# EAGLE board 17341 (EAGLE 7.6.0), part 1 of 2
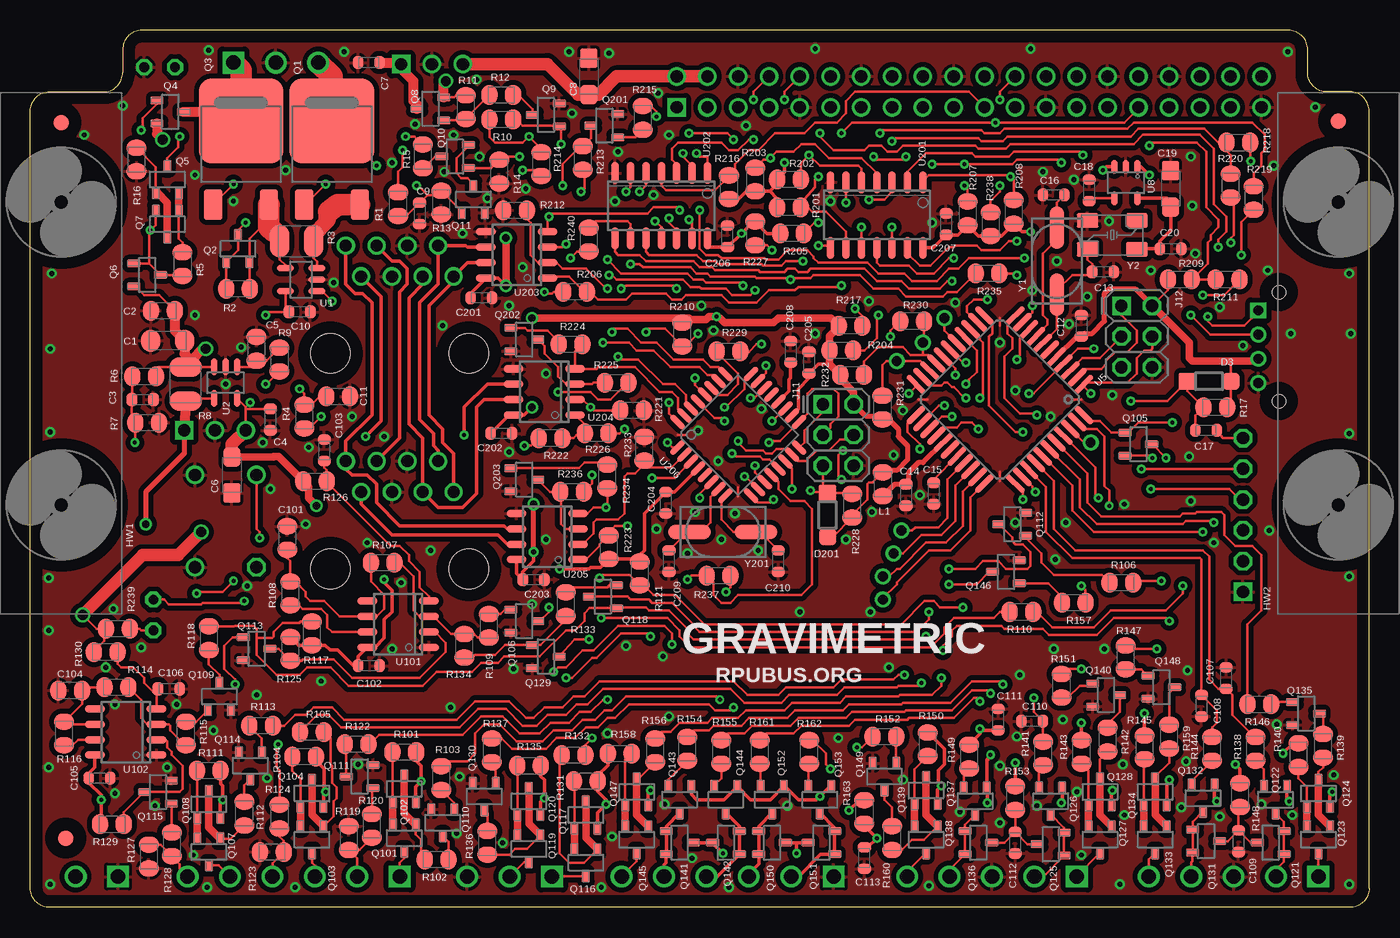
[diagram p3: board, top side]
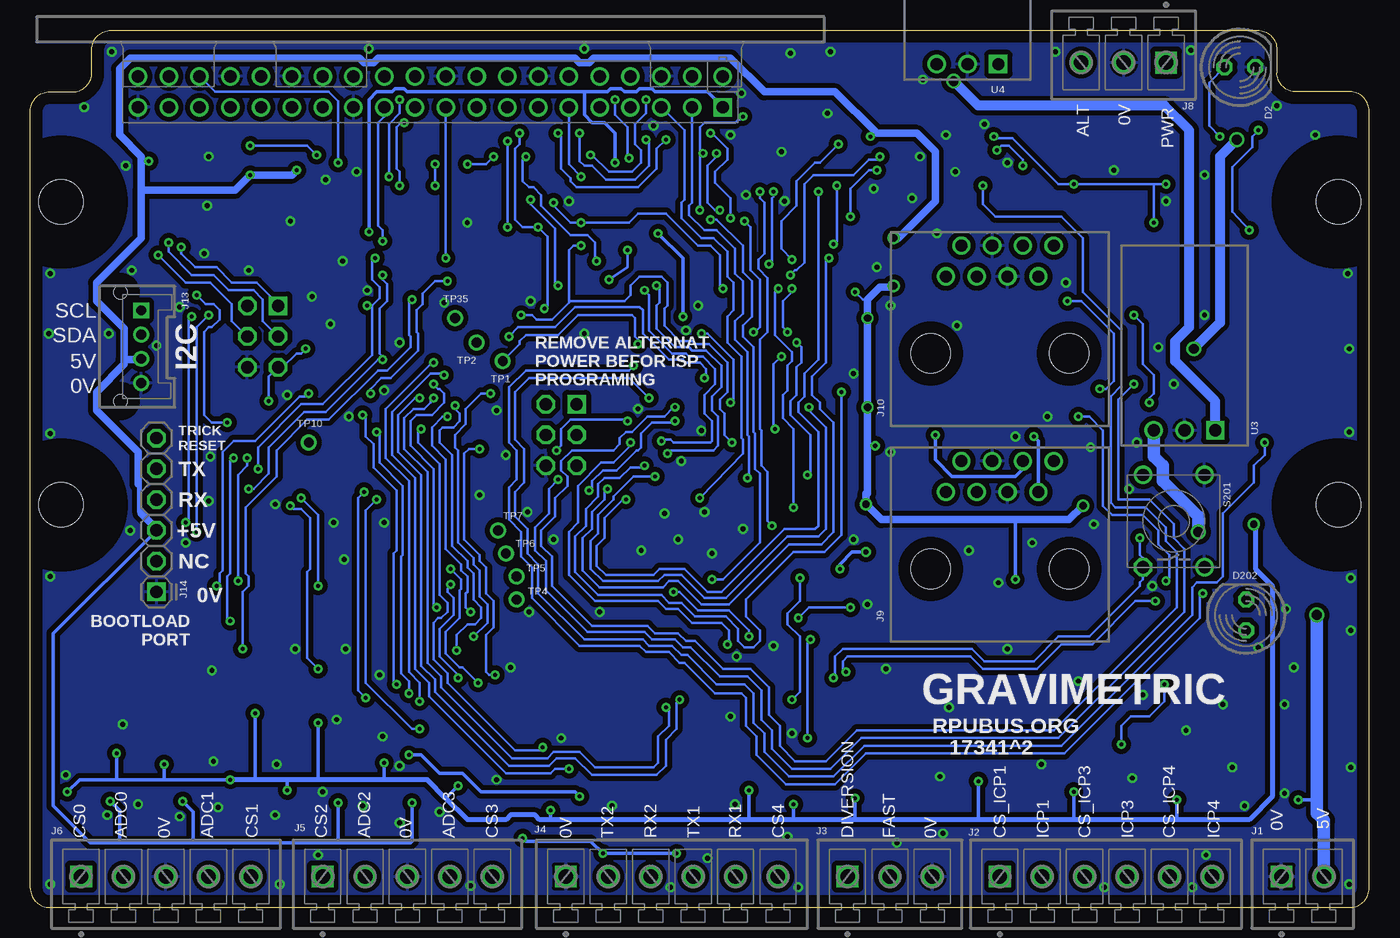
[diagram p4: board, bottom side, seen from below]

Size 110.49 x 72.39 mm. Coordinates in mm from the lower left corner, seen from the top.
Outline: 110.49,1.59 110.49,65.72 arc90 108.9,67.31 107,67.31 arc-90 105.41,68.9 105.41,70.8 arc90 103.82,72.39 9.21,72.39 arc90 7.62,70.8 7.62,68.9 arc-90 6.03,67.31 1.59,67.31 arc90 0,65.72 0,1.59 arc90 1.59,0 108.9,0 arc90 110.49,1.59
Copper layers (1*16): Top 0.034290625mm / dielectric 60mil / Bottom 0.034290625mm
Design rules "default *": minimum track width 7mil, minimum drill 13mil, track to track 12mil, track to pad 10mil, pad to pad 8mil, via to via 12mil, smd to smd 8mil, copper to edge 40mil, drill to drill 16mil, minimum pad ring 10mil, minimum via ring 8mil, stop-mask expansion 4mil, vias tented up to drill 17mil, thermal gap 10mil
Net classes: 0 default: width 0.178 mm, drill 0.33 mm

## Footprints (pad centres in the part's own frame; a part is rotated, then mirrored left to right if it is on the bottom)
C1206(3216) = smd 1.6 x 1.8: 1 -1.4,0; 2 1.4,0
C0805(2012) = smd 1.321 x 1.651: 1 -0.977,0; 2 0.977,0
C0603(1608) = smd 0.898 x 1.1: 1 -0.889,0; 2 0.889,0
3216 = smd 1.6 x 1.4: + -1.5,0; - 1.5,0
LED5MM = drill 0.813 octagon: A -1.27,0; K 1.27,0
SOD123 = smd 1.4 x 1.4: A 1.8,0; C -1.8,0
USA10 = hole 3.658: -12.5,0; 12.5,0
MCV2 = drill 1.2 square: 1 0,0 | drill 1.2: 2 3.5,0
MCV6 = drill 1.2 square: 1 0,0 | drill 1.2: 2 3.5,0; 3 7,0; 4 10.5,0; 5 14,0; 6 17.5,0
MCV3 = drill 1.2 square: 1 0,0 | drill 1.2: 2 3.5,0; 3 7,0
MCV5 = drill 1.2 square: 1 0,0 | drill 1.2: 2 3.5,0; 3 7,0; 4 10.5,0; 5 14,0
RASPI_ZERO_V40PIN = drill 1.016 square: 1 0,2.54 | drill 1.016: 2 0,0; 3 2.54,2.54; 4 2.54,0; 5 5.08,2.54; 6 5.08,0; 7 7.62,2.54; 8 7.62,0; 9 10.16,2.54; 10 10.16,0; 11 12.7,2.54; 12 12.7,0; 13 15.24,2.54; 14 15.24,0; 15 17.78,2.54; 16 17.78,0; 17 20.32,2.54; 18 20.32,0; 19 22.86,2.54; 20 22.86,0; 21 25.4,2.54; 22 25.4,0; 23 27.94,2.54; 24 27.94,0; 25 30.48,2.54; 26 30.48,0; 27 33.02,2.54; 28 33.02,0; 29 35.56,2.54; 30 35.56,0; 31 38.1,2.54; 32 38.1,0; 33 40.64,2.54; 34 40.64,0; 35 43.18,2.54; 36 43.18,0; 37 45.72,2.54; 38 45.72,0; 39 48.26,2.54; 40 48.26,0
RJ45-8HZT = drill 1: 1 -4.445,6.35; 2 -3.175,8.89; 3 -1.905,6.35; 4 -0.635,8.89; 5 0.635,6.35; 6 1.905,8.89; 7 3.175,6.35; 8 4.445,8.89 | hole 3.264: -5.715,0; 5.715,0
ISP = drill 1.016 square: 1 0,0 | drill 1.016 octagon: 2 0,2.54; 3 2.54,0; 4 2.54,2.54; 5 5.08,0; 6 5.08,2.54
B04B = drill 0.8 square: 1 0,0 | drill 0.8: 2 2,0; 3 4,0; 4 6,0 | hole 1.1: 7.5,-1.7; -1.5,-1.7
FRIEND = drill 1.016 square: 1 0,0 | drill 1.016 octagon: 2 2.54,0; 3 5.08,0; 4 7.62,0; 5 10.16,0; 6 12.7,0
DPAK = smd 1.5 x 2.5: 1 -2.3,-6.9; 3 2.3,-6.9 | smd 7 x 7: SINK 0,0
SOT23 = smd 0.65 x 1.06: B -0.95,-1.1; C 0,1.1; E 0.95,-1.1
SOT23' = smd 0.65 x 1.06: 1(G) -0.95,-1.1; 2(S) 0.95,-1.1; 3(D) 0,1.1
C1210(3225) = smd 1.6 x 2.7: 1 -1.4,0; 2 1.4,0
0M311 = drill 1.016 octagon: 1 -3.81,2.54 | drill 1.016: 2 3.81,2.54; 3 -3.81,-2.54; 4 3.81,-2.54
P1-08 = drill 0.813: TP 0,0
SOT23-5 = smd 0.55 x 1.4: 1 -0.95,-1.3; 2 0,-1.3; 3 0.95,-1.3; 4 0.95,1.3; 5 -0.95,1.3
OKI-78SR-H = drill 1.016 square: 1 0,0 | drill 1.016: 2 -2.54,0; 3 -5.08,0
TQFP44 = smd 2 x 0.45: 1 -5.8,4; 2 -5.8,3.2; 3 -5.8,2.4; 4 -5.8,1.6; 5 -5.8,0.8; 6 -5.8,0; 7 -5.8,-0.8; 8 -5.8,-1.6; 9 -5.8,-2.4; 10 -5.8,-3.2; 11 -5.8,-4; 23 5.8,-4; 24 5.8,-3.2; 25 5.8,-2.4; 26 5.8,-1.6; 27 5.8,-0.8; 28 5.8,0; 29 5.8,0.8; 30 5.8,1.6; 31 5.8,2.4; 32 5.8,3.2; 33 5.8,4 | smd 0.45 x 2: 12 -4,-5.8; 13 -3.2,-5.8; 14 -2.4,-5.8; 15 -1.6,-5.8; 16 -0.8,-5.8; 17 0,-5.8; 18 0.8,-5.8; 19 1.6,-5.8; 20 2.4,-5.8; 21 3.2,-5.8; 22 4,-5.8; 34 4,5.8; 35 3.2,5.8; 36 2.4,5.8; 37 1.6,5.8; 38 0.8,5.8; 39 0,5.8; 40 -0.8,5.8; 41 -1.6,5.8; 42 -2.4,5.8; 43 -3.2,5.8; 44 -4,5.8
SOT23-5,SOT25 = smd 0.55 x 1.2: 1 -0.95,-1.3; 2 0,-1.3; 3 0.95,-1.3; 4 0.95,1.3; 5 -0.95,1.3
SOIC8 = smd 0.6 x 1.6: 1 -1.905,-2.54; 2 -0.635,-2.54; 3 0.635,-2.54; 4 1.905,-2.54; 5 1.905,2.54; 6 0.635,2.54; 7 -0.635,2.54; 8 -1.905,2.54
14SOIC = smd 0.6 x 1.8: 1 -3.81,-2.7; 2 -2.54,-2.7; 3 -1.27,-2.7; 4 0,-2.7; 5 1.27,-2.7; 6 2.54,-2.7; 7 3.81,-2.7; 8 3.81,2.7; 9 2.54,2.7; 10 1.27,2.7; 11 0,2.7; 12 -1.27,2.7; 13 -2.54,2.7; 14 -3.81,2.7
TQFP32-08 = smd 1.5 x 0.45: 1 -4.293,2.8; 2 -4.293,2; 3 -4.293,1.2; 4 -4.293,0.4; 5 -4.293,-0.4; 6 -4.293,-1.2; 7 -4.293,-2; 8 -4.293,-2.8; 17 4.293,-2.8; 18 4.293,-2; 19 4.293,-1.2; 20 4.293,-0.4; 21 4.293,0.4; 22 4.293,1.2; 23 4.293,2; 24 4.293,2.8 | smd 0.45 x 1.5: 9 -2.8,-4.293; 10 -2,-4.293; 11 -1.2,-4.293; 12 -0.4,-4.293; 13 0.4,-4.293; 14 1.2,-4.293; 15 2,-4.293; 16 2.8,-4.293; 25 2.8,4.293; 26 2,4.293; 27 1.2,4.293; 28 0.4,4.293; 29 -0.4,4.293; 30 -1.2,4.293; 31 -2,4.293; 32 -2.8,4.293
FIDUCIAL-1.27 = smd 1.27 x 1.27: 1 0,0
CSM-3X = smd 3.5 x 1.2: 1 -2.75,0; 2 2.75,0
CRYSTAL5X3.2MM = smd 1.778 x 1.194: 1 -2.032,-1.194; 2 2.032,-1.194; 3 2.032,1.194; 4 -2.032,1.194

## Placement (x,y rotation side)
C1  10uF  [C1206(3216)]  11.34,46.77 180 top
C2  .1uF  [C0805(2012)]  10.94,49.25 180 top
C3  .01uF  [C0603(1608)]  9.27,41.91 0 top
C4  .1uF  [C0603(1608)]  19.81,40.26 270 top
C5  1uF  [C0805(2012)]  18.67,46.1 90 top
C6  106A  [3216]  16.64,35.69 270 top
C7  .1uF  [C0603(1608)]  27.94,69.72 180 top
C8  10uF  [3216]  46.1,68.58 90 top
C9  .01uF  [C0603(1608)]  32.13,57.28 270 top
C10  .1uF  [C0603(1608)]  22.23,49.15 0 top
C11  1uF  [C0805(2012)]  25.4,42.16 0 top
C12  .1uF  [C0603(1608)]  86.74,48.01 90 top
C13  27pF  [C0603(1608)]  88.52,52.45 180 top
C14  .1uF  [C0603(1608)]  72.26,34.04 270 top
C15  .1uF  [C0603(1608)]  74.55,34.16 270 top
C16  27pF  [C0603(1608)]  84.45,58.8 0 top
C17  .1uF  [C0603(1608)]  97.03,39.37 0 top
C18  470pF  [C0603(1608)]  87.38,59.18 90 top
C19  10uF  [3216]  94.11,59.31 90 top
C20  .1uF  [C0603(1608)]  94.11,54.36 0 top
C101  .01uF  [C0805(2012)]  21.21,30.48 90 top
C102  100nF  [C0603(1608)]  27.94,19.94 0 top
C103  100nF  [C0603(1608)]  24.26,37.72 90 top
C104  0.01uF  [C0805(2012)]  3.3,17.91 180 top
C105  100nF  [C0603(1608)]  5.71,10.67 0 top
C106  100nF  [C0603(1608)]  11.43,18.03 0 top
C107  .01uF  [C0603(1608)]  98.68,18.92 90 top
C108  .01uF  [C0603(1608)]  96.65,16.64 270 top
C109  .1uF  [C0603(1608)]  99.7,5.46 270 top
C110  .01uF  [C0603(1608)]  82.68,15.37 180 top
C111  .01uF  [C0603(1608)]  79.88,15.49 90 top
C112  .1uF  [C0603(1608)]  81.28,5.33 270 top
C113  .1uF  [C0603(1608)]  68.83,4.06 270 top
C201  .1uF  [C0603(1608)]  37.21,50.29 0 top
C202  .1uF  [C0603(1608)]  38.86,39.12 0 top
C203  .1uF  [C0603(1608)]  41.53,27.05 0 top
C204  .1uF  [C0603(1608)]  52.45,33.4 270 top
C205  .1uF  [C0603(1608)]  64.26,44.96 90 top
C206  .1uF  [C0603(1608)]  57.53,55.37 90 top
C207  .1uF  [C0603(1608)]  75.56,56.39 90 top
C208  .1uF  [C0603(1608)]  62.74,45.85 90 top
C209  27pF  [C0603(1608)]  52.7,28.57 270 top
C210  27pF  [C0603(1608)]  61.72,28.57 270 top
D2  5MMGN  [LED5MM]  10.67,69.34 0 bottom
D3  T4  [SOD123]  97.28,43.43 180 top
D201  T4  [SOD123]  65.79,32.38 90 top
D202  5MMRD  [LED5MM]  10.16,24.13 90 bottom
HW1  USA10-4,6  [USA10]  2.54,45.72 90 top
HW2  USA10-4,6  [USA10]  107.95,45.72 90 top
J1  PST1,0/2-3,5  [MCV2]  7.24,2.54 0 bottom
J2  PST1,0/6-3,5  [MCV6]  30.48,2.54 0 bottom
J3  PST1,0/3-3,5  [MCV3]  43.05,2.54 0 bottom
J4  [MCV6]  66.29,2.54 0 bottom
J5  PST1,0/5-3,5  [MCV5]  86.36,2.54 0 bottom
J6  PST1,0/5-3,5  [MCV5]  106.3,2.54 0 bottom
J7  Pi Zero  [RASPI_ZERO_V40PIN]  53.34,68.58 180 bottom
J8  PST1,0/3-3,5  [MCV3]  16.76,69.72 180 bottom
J9  RJ45J  [RJ45-8HZT]  30.48,27.94 0 bottom
J10  RJ45J  [RJ45-8HZT]  30.48,45.72 0 bottom
J11  [ISP]  65.41,41.53 270 top
J12  ICSP  [ISP]  90.04,49.66 270 top
J13  S04B  [B04B]  101.35,49.28 270 bottom
J14  FRIEND  [FRIEND]  100.08,26.04 90 bottom
L1  JMP  [C0805(2012)]  70.36,34.92 270 top
Q1  IRFR5305  [DPAK]  24.89,64.9 0 top
Q2  K1N  [SOT23]  17.14,54.36 0 top
Q3  IRFR5305  [DPAK]  17.4,64.9 0 top
Q4  P65  [SOT23']  11.56,65.66 270 top
Q5  K3N  [SOT23]  11.3,60.07 0 top
Q6  K1N  [SOT23]  9.65,52.2 270 top
Q7  K3N  [SOT23]  11.3,56.39 180 top
Q8  P65  [SOT23']  33.02,65.91 90 top
Q9  K38  [SOT23']  42.54,65.41 90 top
Q10  K38  [SOT23']  35.05,61.98 90 top
Q11  K38  [SOT23']  36.58,58.42 0 top
Q101  K3N  [SOT23]  30.86,5.71 180 top
Q102  K3N  [SOT23]  30.86,9.78 0 top
Q103  K3N  [SOT23]  23.24,5.59 180 top
Q104  K3N  [SOT23]  23.24,9.4 0 top
Q105  K38  [SOT23']  91.44,38.23 270 top
Q106  K1N  [SOT23]  40.77,23.62 270 top
Q107  K3N  [SOT23]  14.73,4.57 180 top
Q108  K3N  [SOT23]  14.73,8.51 0 top
Q109  K1N  [SOT23]  15.62,17.4 0 top
Q110  K1N  [SOT23]  34.04,6.99 180 top
Q111  K1N  [SOT23]  27.18,10.79 90 top
Q112  K1N  [SOT23]  81.03,31.62 90 top
Q113  K1N  [SOT23]  18.67,21.34 270 top
Q114  K1N  [SOT23]  18.16,11.68 180 top
Q115  K1N  [SOT23]  10.54,9.53 90 top
Q116  K3N  [SOT23]  45.85,3.68 180 top
Q117  K3N  [SOT23]  45.85,7.62 0 top
Q118  K38  [SOT23']  47.24,25.65 90 top
Q119  K3N  [SOT23]  41.15,4.83 180 top
Q120  K3N  [SOT23]  41.15,8.76 0 top
Q121  K1N  [SOT23]  102.36,5.33 90 top
Q122  K38  [SOT23']  102.74,8.89 180 top
Q123  K3N  [SOT23]  106.3,5.59 180 top
Q124  K3N  [SOT23]  106.3,9.4 0 top
Q125  K1N  [SOT23]  84.2,5.21 90 top
Q126  K38  [SOT23']  84.2,8.76 180 top
Q127  K3N  [SOT23]  88.27,5.59 180 top
Q128  K3N  [SOT23]  88.27,9.53 0 top
Q129  K1N  [SOT23]  42.54,20.7 270 top
Q130  K1N  [SOT23]  37.46,9.14 180 top
Q131  K1N  [SOT23]  97.03,5.46 270 top
Q132  K38  [SOT23']  96.77,9.02 180 top
Q133  K3N  [SOT23]  92.84,5.59 180 top
Q134  K3N  [SOT23]  92.84,9.53 0 top
Q135  K1N  [SOT23]  105.28,16 270 top
Q136  K1N  [SOT23]  78.23,5.33 270 top
Q137  K38  [SOT23']  77.98,8.76 180 top
Q138  K3N  [SOT23]  73.91,5.59 180 top
Q139  K3N  [SOT23]  73.91,9.65 0 top
Q140  K1N  [SOT23]  88.77,17.53 270 top
Q141  K1N  [SOT23]  53.59,5.33 270 top
Q142  K1N  [SOT23]  57.4,5.33 90 top
Q143  K38  [SOT23']  53.59,8.89 180 top
Q144  K38  [SOT23']  57.4,8.89 180 top
Q145  K3N  [SOT23]  50.04,5.59 180 top
Q146  K1N  [SOT23]  80.52,27.69 90 top
Q147  K3N  [SOT23]  50.04,9.53 0 top
Q148  K1N  [SOT23]  93.34,18.16 270 top
Q149  K1N  [SOT23]  70.48,10.79 180 top
Q150  K1N  [SOT23]  61.21,5.33 270 top
Q151  K1N  [SOT23]  65.28,5.33 90 top
Q152  K38  [SOT23']  61.21,8.89 180 top
Q153  K38  [SOT23']  65.15,8.89 180 top
Q201  K1N  [SOT23]  47.37,64.52 90 top
Q202  K1N  [SOT23]  40.77,46.86 270 top
Q203  K1N  [SOT23]  40.77,35.31 270 top
R1  100k  [C0805(2012)]  30.35,58.04 90 top
R2  100k  [C0805(2012)]  17.14,51.05 0 top
R3  0.018  [C1210(3225)]  21.97,54.99 0 top
R4  10k  [C0805(2012)]  22.61,40.51 90 top
R5  1K  [C0805(2012)]  12.57,53.09 270 top
R6  100k  [C0805(2012)]  9.4,43.81 0 top
R7  15.8k  [C0805(2012)]  9.65,40.01 180 top
R8  0.068  [C1210(3225)]  12.83,43.18 90 top
R9  10k  [C0805(2012)]  20.57,45.21 90 top
R10  10k  [C0805(2012)]  38.86,65.02 180 top
R11  100k  [C0805(2012)]  35.94,66.04 270 top
R12  80.6k  [C0805(2012)]  38.86,67.06 0 top
R13  10k  [C0805(2012)]  33.91,58.17 90 top
R14  10k  [C0805(2012)]  38.7,60.72 270 top
R15  49.9k  [C0805(2012)]  32.38,61.98 90 top
R16  100k  [C0805(2012)]  8.76,61.72 90 top
R17  10K  [C0805(2012)]  97.79,41.27 0 top
R101  32.4  [C0805(2012)]  30.86,12.83 0 top
R102  49.9k  [C0805(2012)]  33.53,3.94 180 top
R103  10k  [C0805(2012)]  33.91,10.67 270 top
R104  32.4  [C0805(2012)]  22.61,12.45 0 top
R105  49.9k  [C0805(2012)]  23.24,14.48 0 top
R106  10k  [C0805(2012)]  90.04,26.8 180 top
R107  100k  [C0805(2012)]  29.08,28.45 0 top
R108  182  [C0805(2012)]  21.46,25.91 270 top
R109  10k  [C0805(2012)]  37.85,23.24 90 top
R110  182  [C0805(2012)]  81.79,24.38 180 top
R111  32.4  [C0805(2012)]  14.73,11.3 0 top
R112  49.9k  [C0805(2012)]  17.65,7.75 270 top
R113  10k  [C0805(2012)]  19.05,14.99 180 top
R114  100k  [C0805(2012)]  7.11,18.16 0 top
R115  10k  [C0805(2012)]  12.83,14.35 90 top
R116  182  [C0805(2012)]  2.79,14.35 270 top
R117  10k  [C0805(2012)]  23.24,22.61 90 top
R118  182  [C0805(2012)]  14.73,22.23 90 top
R119  100  [C0805(2012)]  26.29,5.71 270 top
R120  10k  [C0805(2012)]  28.19,6.73 90 top
R121  10k  [C0805(2012)]  50.29,27.56 270 top
R122  182  [C0805(2012)]  26.92,13.46 0 top
R123  100  [C0805(2012)]  19.94,4.57 0 top
R124  10k  [C0805(2012)]  20.57,7.49 90 top
R125  10k  [C0805(2012)]  21.46,21.34 270 top
R126  100k  [C0805(2012)]  23.5,35.18 180 top
R127  100  [C0805(2012)]  9.78,4.19 90 top
R128  10k  [C0805(2012)]  11.68,5.21 90 top
R129  10k  [C0805(2012)]  6.73,6.86 0 top
R130  100k  [C0805(2012)]  6.22,21.08 180 top
R131  27  [C0805(2012)]  45.85,10.41 0 top
R132  49.9k  [C0805(2012)]  44.83,12.57 180 top
R133  10k  [C0805(2012)]  44.2,25.02 270 top
R134  10k  [C0805(2012)]  35.81,21.59 270 top
R135  27  [C0805(2012)]  41.15,11.68 0 top
R136  49.9k  [C0805(2012)]  37.72,5.33 270 top
R137  10k  [C0805(2012)]  38.1,12.95 270 top
R138  127  [C0805(2012)]  101.09,13.08 90 top
R139  49.9k  [C0805(2012)]  106.68,13.34 270 top
R140  27  [C0805(2012)]  104.65,12.57 90 top
R141  127  [C0805(2012)]  83.57,12.7 90 top
R142  49.9k  [C0805(2012)]  88.9,13.84 270 top
R143  27  [C0805(2012)]  86.74,12.83 90 top
R144  127  [C0805(2012)]  97.54,13.08 90 top
R145  27  [C0805(2012)]  91.95,13.21 90 top
R146  10k  [C0805(2012)]  101.41,16.76 180 top
R147  10k  [C0805(2012)]  90.39,20.63 90 top
R148  100K  [C0805(2012)]  99.82,9.27 270 top
R149  127  [C0805(2012)]  77.47,12.45 90 top
R150  27  [C0805(2012)]  74.04,13.46 90 top
R151  10k  [C0805(2012)]  85.09,18.29 90 top
R152  10k  [C0805(2012)]  70.48,14.1 180 top
R153  100K  [C0805(2012)]  81.28,9.02 270 top
R154  127  [C0805(2012)]  54.23,13.08 90 top
R155  127  [C0805(2012)]  57.02,12.83 90 top
R156  49.9k  [C0805(2012)]  51.56,12.95 270 top
R157  10k  [C0805(2012)]  86.11,25.15 0 top
R158  27  [C0805(2012)]  48.64,12.7 180 top
R159  49.9k  [C0805(2012)]  93.98,14.1 270 top
R160  49.9k  [C0805(2012)]  71.12,5.71 270 top
R161  127  [C0805(2012)]  60.2,12.83 90 top
R162  127  [C0805(2012)]  64.26,12.83 90 top
R163  100K  [C0805(2012)]  68.83,7.87 270 top
R201  10k  [C0805(2012)]  62.61,57.78 0 top
R202  10k  [C0805(2012)]  62.61,60.07 0 top
R203  1.82k  [C0805(2012)]  59.82,60.07 270 top
R204  3.01k  [C0805(2012)]  66.93,45.97 180 top
R205  3.01k  [C0805(2012)]  62.87,55.63 180 top
R206  10k  [C0805(2012)]  44.96,50.8 180 top
R207  10k  [C0805(2012)]  77.34,57.28 270 top
R208  10k  [C0805(2012)]  81.15,57.4 270 top
R209  3.01k  [C0805(2012)]  94.87,51.82 0 top
R210  10k  [C0805(2012)]  53.81,47.28 90 top
R211  182  [C0805(2012)]  98.81,51.82 180 top
R212  3.01k  [C0805(2012)]  40,57.53 0 top
R213  3.01k  [C0805(2012)]  45.59,61.85 270 top
R214  10K  [C0805(2012)]  42.16,61.34 270 top
R215  100k  [C0805(2012)]  50.55,65.15 90 top
R216  1.82k  [C0805(2012)]  57.66,59.44 90 top
R217  3.01k  [C0805(2012)]  67.69,48.01 0 top
R218  3.01k  [C0805(2012)]  99.7,63.12 180 top
R219  182  [C0805(2012)]  100.97,58.55 90 top
R220  182  [C0805(2012)]  99.06,59.56 90 top
R221  3.01k  [C0805(2012)]  49.66,41.02 180 top
R222  10k  [C0805(2012)]  42.93,38.73 180 top
R223  10k  [C0805(2012)]  47.75,29.72 270 top
R224  100k  [C0805(2012)]  44.58,46.48 0 top
R225  3.01k  [C0805(2012)]  48.39,43.31 0 top
R226  1.82k  [C0805(2012)]  46.74,39.12 0 top
R227  10K  [C0805(2012)]  59.82,55.63 270 top
R228  10K  [C0805(2012)]  67.82,33.15 270 top
R229  182  [C0805(2012)]  57.62,45.88 180 top
R230  182  [C0805(2012)]  72.77,48.39 180 top
R231  3.01k  [C0805(2012)]  70.32,41.26 270 top
R232  3.01k  [C0805(2012)]  67.82,43.94 180 top
R233  3.01k  [C0805(2012)]  50.67,37.85 90 top
R234  100k  [C0805(2012)]  47.62,35.56 90 top
R235  182  [C0805(2012)]  78.99,52.32 180 top
R236  3.01k  [C0805(2012)]  44.7,34.29 180 top
R237  1.82k  [C0805(2012)]  56.8,27.38 180 top
R238  10K  [C0805(2012)]  79.25,56.39 270 top
R239  1.82k  [C0805(2012)]  7.24,22.99 0 top
R240  10k  [C0805(2012)]  46.1,55.12 90 top
S201  KSA0M311  [0M311]  16.13,31.88 90 bottom
TP1  TPPAD1-08  [P1-08]  71.5,45.09 0 bottom
TP2  TPPAD1-08  [P1-08]  73.66,46.61 0 bottom
TP4  TPPAD1-08  [P1-08]  70.36,25.4 0 bottom
TP5  TPPAD1-08  [P1-08]  70.36,27.3 0 bottom
TP6  TPPAD1-08  [P1-08]  71.25,29.21 0 bottom
TP7  TPPAD1-08  [P1-08]  71.88,31.11 0 bottom
TP10  TPPAD1-08  [P1-08]  87.5,38.35 0 bottom
TP35  TPPAD1-08  [P1-08]  75.44,48.64 0 bottom
U1  1087  [SOT23-5]  22.35,51.82 90 top
U2  1087  [SOT23-5]  16.13,43.31 180 top
U3  I50115  [OKI-78SR-H]  12.7,39.37 0 bottom
U4  I50115  [OKI-78SR-H]  30.61,69.6 0 bottom
U5  ATMEGA324PB-AU  [TQFP44]  80.01,41.91 225 top
U8  KB33  [SOT23-5,SOT25]  90.42,59.82 180 top
U101  ICM7555  [SOIC8]  30.35,23.37 90 top
U102  ICM7555  [SOIC8]  7.87,14.48 90 top
U201  74LVC07A  [14SOIC]  69.85,57.15 180 top
U202  74LVC07A  [14SOIC]  52.07,57.91 180 top
U203  THVD1500  [SOIC8]  40.13,53.85 90 top
U204  THVD1500  [SOIC8]  42.42,42.55 90 top
U205  THVD1500  [SOIC8]  42.67,30.61 90 top
U206  ATMEGA328PB-AU  [TQFP32-08]  58.42,38.99 45 top
U$1  R-PI3B+  [R-PI3B+]  77.47,67.31 0 bottom
U$2  FIDUCIAL1.27  [FIDUCIAL-1.27]  107.95,64.9 0 top
U$3  FIDUCIAL1.27  [FIDUCIAL-1.27]  2.54,64.77 0 top
U$4  FIDUCIAL1.27  [FIDUCIAL-1.27]  2.92,5.71 0 top
Y1  16MHz  [CSM-3X]  84.71,53.34 90 top
Y2  FT5HNBPK16  [CRYSTAL5X3.2MM]  89.28,55.5 180 top
Y201  12MHz  [CSM-3X]  57.15,30.99 0 top

## Tracks (layer width: path | path; a pad name or v marks a point on that pad's centre or on a via)
0V  (via drill 0.41)
  Top 0.203: 53.47,38.99 54.1,38.99 | 58.42,33.91 58.42,34.67 | 80.01,35.18 80.01,35.94 | 86.11,41.91 86.74,41.91 | 74.04,41.91 73.28,41.91 | 80.01,48.01 80.01,48.64
  other vias: 4.45,63.75 1.78,52.32 1.65,46.1 1.65,39.24 1.52,27.18 1.65,1.91 44.45,70.61 47.75,70.48 25.91,70.61 29.21,38.86 36.83,68.33 6.99,9.4 6.99,16.76 11.3,11.56 10.29,8.38 1.52,22.86 1.52,11.56 51.69,31.24 81.28,42.67 100.08,46.35 29.84,21.34 30.61,26.8 27.05,11.81 35.18,6.1 48.01,5.84 52.32,8.51 54.61,4.06 85.47,31.75 58.17,32.51 60.32,41.15 56.77,36.83 54.23,29.21 54.86,32.64 57.02,30.35 74.42,56.52 87.25,50.42 84.71,53.34 82.68,50.93 86.11,60.07 89.03,56.64 64.77,47.37 60.07,29.46 40.64,52.83 39.5,49.66 42.54,44.07 90.3,33.27 95.63,37.21 89.28,42.29 98.17,49.53 104.01,47.37 102.11,52.58 102.62,61.21 106.05,66.04 108.84,52.32 108.97,47.37 95.76,33.53 102.23,31.11 108.84,27.3 108.84,1.91 89.92,1.91 74.17,1.78 62.48,8.38 57.66,1.65 47.12,1.65 21.84,1.65 14.61,1.65 19.56,10.67 15.11,14.61 9.14,21.46 6.22,19.81 42.54,30.35 27.81,30.1 33.02,29.46 41.4,25.02 24,18.67 18.67,17.53 34.67,16.51 39.88,19.68 49.15,21.59 70.87,19.81 81.66,19.18 88.65,21.34 95.5,19.56 95,8.26 85.22,15.49 86.74,4.32 83.06,8.38 80.01,6.99 76.71,7.87 80.01,11.68 81.41,14.1 84.45,21.34 69.34,24.38 7.62,66.17 14.73,70.74 25.02,51.56 31.75,64.64 34.92,63.75 37.72,58.55 44.7,65.53 48.51,62.36 40.89,59.31 35.69,55.63 34.04,48.01 51.43,58.8 59.05,64.52 103.76,70.61 95.76,61.98 95.89,57.91 92.46,52.58 83.57,60.71 66.04,58.29 85.73,48.13 108.84,39.12 97.66,30.1 84.58,28.7 52.2,20.7 63.5,24.38 69.47,32.64 67.31,30.35 66.67,13.97 16.13,43.18 19.18,38.35 22.99,37.97 26.54,40.51 22.73,31.62 19.81,34.54 6.86,24.64 64.77,70.87 82.55,70.87 96.14,53.98 107.57,10.92 104.14,7.62 98.17,7.49 101.6,8.51 102.87,15.11 95.38,12.06 90.17,11.81 90.3,7.62 86.36,9.53 72.01,10.54 48.26,58.29 51.82,67.18 52.7,63.75 17.4,46.23 13.59,48.9 17.91,26.54 16.76,58.29 13.59,60.45 21.08,60.83 29.84,61.47 34.16,60.71 37.08,61.98 69.22,50.04 76.33,49.91 55.37,49.66 81.28,31.75 55.12,39.37 39.5,37.59 56.39,47.62 71.25,37.34 73.41,34.04 52.7,15.75 47.62,14.35 35.43,10.79 38.99,5.33 13.46,4.32 12.07,16.76 72.01,41.02 80.01,46.61 84.2,40.51
  pour Bottom (isolate 0.406): 0,72.39 110.49,72.39 110.49,0 0,0
  pour Top (isolate 0.406, rank 6): 0,72.39 110.49,72.39 110.49,0 0,0
!RESET!  (via drill 0.33)
  Top 0.203: v87.76,46.1 86.46,46.1 U5.4 82.78,42.42 v82.42,42.42 | C17.1 96.14,40.6 R17.1 95.48,42.61 D3.A 93.83,41.78 v90.81,41.78 | U202.8 48.26,54.1 48.51,53.85 50.29,53.85 50.8,53.34 54.74,53.34 55.24,52.83 56.26,52.83 56.51,52.58 60.07,52.58 60.2,52.45 62.23,52.45 62.48,52.7 63.12,52.7 63.37,52.45 64.14,52.45 64.39,52.7 68.83,52.7 69.85,51.69 71.88,51.69 72.52,51.05 75.06,51.05 75.69,51.69 v76.07,51.69
  Bottom 0.203: v90.81,41.78 90.81,43.81 J12.5 89.66,44.58 88.52,45.72 88.14,45.72 v87.76,46.1 | v82.42,42.42 82.42,42.8 81.53,43.69 80.77,43.69 78.49,45.97 78.49,47.37 78.61,47.5 78.61,49.28 78.11,49.78 78.11,50.67 77.09,51.69 v76.07,51.69
!SS  (via drill 0.33)
  Top 0.203: v94.23,40.01 91.44,40.01 90.61,39.18 Q105.1(G) 89.22,39.18 88.27,40.13 87.45,40.13 U5.44 | v96.77,50.55 98.51,50.55 R211.1
  Bottom 0.203: v94.23,40.01 95.5,40.01 96.14,40.64 96.14,47.5 95.76,47.88 95.5,47.88 94.87,48.51 94.87,49.28 95.38,49.78 96.01,49.78 v96.77,50.55
+3V3
  Top 0.305: U8.5 93.8,58.52 C19.+ 94.11,55.88 93.22,54.99 C20.1 91.36,54.36 Y2.4
+5V  (via drill 0.33, 0.41, 0.61, 0.81)
  Top 0.203: U3.3 17.78,41.15 | 17.78,41.15 17.78,41.31 | 17.78,41.31 U2.5 | v4.32,24.13 5.46,22.99 R239.1 6.1,22.82 6.1,21.97 5.25,21.12 R130.2 | R214.1 42.16,62.61 v41.15,63.63 40.64,63.12 38.35,63.12 37.88,63.59 R10.2 | R17.2 99.08,41.59 D3.C 99.06,43.46 99.06,45.09 | J12.2 93.89,50.97 R209.1 | R218.1 100.67,61.63 v100.71,61.59 | L1.1 69.51,35.05 69.22,35.05 69.09,34.92 69.09,33.66 67.82,32.38 R228.2 66.23,30.59 D201.C | R222.2 41.31,38.1 v40.77,38.1 | C4.1 17.78,41.15 | R210.2 53.81,48.6 53.85,48.64 | Q137.1(G) 78.99,9.8 | v18.16,41.66 18.13,41.66 17.78,41.31 | v19.43,48.9 19.68,49.15 C10.1 21.05,49.43 U1.5 | R206.2 43.18,50.8 43.05,50.67 42.54,50.67 v42.42,50.8
  Top 0.305: U8.3 88.8,61.12 v88.52,60.83 | U8.1 91.66,61.12 v92.33,60.45 | R129.1 5.84,6.95 v5.84,8.89 5.84,9.27 4.83,10.29 C105.1 4.83,11.05 5.33,11.56 U102.8 | v29.21,27.05 29.21,26.8 29.84,26.16 29.84,24.38 29.21,23.75 29.21,22.23 28.45,21.46 U101.8 27.05,20.7 C102.1 26.67,19.94 25.36,21.25 24.73,21.25 24.34,21.63 R117.1 22.15,21.63 R125.1 | v41.53,29.34 41.53,28.57 40.64,27.69 C203.1 40.13,27.56 U205.8 | Q143.1(G) 54.54,9.34 54.99,8.89 57.25,8.89 Q144.1(G) 58.35,9.97 59.44,8.89 61.06,8.89 Q152.1(G) 62.27,9.99 63.37,8.89 64.87,8.89 65,8.99 v65.15,9.14 66,9.99 Q153.1(G) | Q126.1(G) 85.15,8.7 v85.09,8.64 | Q132.1(G) 97.72,8.96 v97.92,8.76 | Q122.1(G) 103.69,8.96 v103.89,8.76 | C201.1 36.32,50.67 U203.8 38.61,51.94 v39.24,51.31 | U202.14 55.97,54.48 C206.1 v58.67,55.63 59.65,56.6 R227.1 60.79,55.63 R205.2 | Q137.1(G) 78.93,12.13 v79.25,12.57 | U206.18 63.37,41.11 63.37,42.8 64.26,43.69 C205.1 65.02,44.83 65.95,44.83 | U206.4 53.15,34.29 C204.1 50.67,32.51 50.67,29.46 50.29,29.08 R121.1 50.09,28.74 R223.2 47.08,28.07 46.23,28.07 46.1,27.94 v43.69,27.94 | v41.4,41.27 40.77,40.64 U204.8 39.5,40.64 C202.1 | 78.99,9.8 v78.99,8.64
  Top 0.406: U5.5 86.35,47.12 C12.1 87,47.37 87.63,47.37 88.65,48.39 88.65,50.67 89.03,51.05 91.19,51.05 J12.2 | v41.53,29.34 v41.53,33.27 | J11.2 68.96,40.51 70.09,40.51 R231.2 70.36,40.24 70.36,40.26 70.87,40.26 71.63,39.5 71.63,38.86 72.39,38.1 72.39,36.96 71.5,36.07 70.52,36.07 L1.1
  Top 0.61: J13.3 101.22,45.09 99.06,45.09 95.89,45.09 95.63,45.34 95.63,46.61 J12.2 | v39.24,55.24 v39.24,51.31 | v41.4,48.64 53.85,48.64 54.36,48.64 54.48,48.51 55.75,48.51 56.01,48.77 v56.64,48.77 56.9,48.64 57.28,48.26 61.34,48.26 61.72,48.64 66.08,48.64 R217.1 66.67,47.88 65.95,47.16 R204.2 65.95,44.83 R232.2 66.84,43.65 67.95,42.55 J11.2 | C6.+ 20.09,37.19 20.07,37.21 20.49,37.21 R126.2 22.99,34.71 22.99,33.78 v23.62,33.15
  Top 1.016: C6.+ 16.64,38.23 U3.3 | v14.1,30.99 12.19,29.08 9.27,29.08 v4.32,24.13
  Bottom 0.203: 41.4,50.16 41.78,50.16 v42.42,50.8 | v100.71,61.59 101.22,61.59 101.35,61.47 | v40.77,38.1 41.4,38.1 | v41.15,63.63 40.77,64.01 | v18.16,41.66 18.16,42.04 17.78,42.42 17.78,43.94 18.67,44.83 18.67,48.13 v19.43,48.9
  Bottom 0.305: J14.3 108.59,22.61 108.59,8.38 105.54,5.33 103.12,5.33 | 4.32,8.89 v5.84,8.89 | v29.21,27.05 29.21,32 | v103.89,8.76 103.12,8 103.12,5.33 | v97.92,8.76 97.03,7.87 97.03,5.33 | 97.03,5.33 103.12,5.33 | v78.99,8.64 78.99,5.46 79.12,5.33 85.09,5.33 | 85.09,5.33 97.03,5.33 | v85.09,8.64 85.09,5.33 | v41.53,29.34 42.67,29.34 43.69,28.32 v43.69,27.94 | v56.64,48.77 56.64,53.59 v58.67,55.63 | v79.25,12.57 78.23,12.57 76.71,11.05 74.8,11.05 73.28,9.53 65.53,9.53 v65.15,9.14
  Bottom 0.406: 101.35,32.51 101.47,32.64 101.47,34.8 101.6,34.92
  Bottom 0.61: v23.62,33.15 24.77,32 29.21,32 40.26,32 v41.53,33.27 41.53,34.16 41.4,34.29 | J14.3 100.08,31.24 101.35,32.51 | 102.74,45.21 102.74,44.83 105.03,42.55 105.03,41.02 101.6,37.59 101.6,34.92 | 102.74,45.21 101.41,45.21 J13.3 | 102.74,45.21 102.74,47.75 105.03,50.04 105.03,51.56 101.35,55.24 101.35,59.18 | v88.52,60.83 88.9,60.45 v92.33,60.45 93.6,59.18 101.35,59.18 | 41.4,34.29 41.4,38.1 v41.4,41.27 v41.4,48.64 41.4,50.16 40.39,51.18 39.24,51.18 v39.24,51.31 | v39.24,55.24 38.86,55.24 35.81,58.29 35.81,62.36 37.34,63.88 40.64,63.88 40.77,64.01 44.07,67.31 49.91,67.31 52.7,70.1 64.01,70.1 64.39,69.72 65.15,69.72 65.53,70.1 81.79,70.1 82.17,69.72 82.93,69.72 83.31,70.1 102.23,70.1 103.12,69.22 103.12,63.75 101.35,61.98 101.35,61.47 101.35,59.18 | 41.4,34.16 41.4,34.29
  Bottom 1.016: U3.3 17.78,37.21 17.02,36.45 17.02,35.18 14.1,32.26 v14.1,30.99 | v4.32,24.13 4.32,8.89 4.32,7.75 3.74,7.17 J1.2
+5V_2PI
  Top 1.016: U4.3 42.67,69.6 45.19,67.08 C8.+ 46.89,67.08 48.39,68.58 | 48.39,68.58 J7.2 J7.4 | 48.36,68.58 48.39,68.58
+DTR  (via drill 0.33)
  Top 0.305: J10.6 29.84,53.34 30.48,53.34 31.11,52.7 31.11,51.44 30.48,50.8 30.48,38.73 J9.6 | U204.6 37.72,43.18 35.81,41.27 v35.81,38.99
  Bottom 0.305: v35.81,38.99 35.81,36.96 34.42,35.56 29.21,35.56 28.57,36.2 J9.6
+RX
  Top 0.305: U205.6 39.37,31.24 39.12,31.5 30.48,31.5 28.57,33.4 28.57,34.92 27.81,35.69 26.54,35.69 26.04,36.2 J9.8 26.04,38.48 28.19,40.64 28.19,49.91 27.43,50.67 26.8,50.67 26.04,51.44 J10.8
+TX
  Top 0.305: J9.2 33.65,37.72 33.27,38.1 33.27,39.12 32.13,40.26 32.13,49.91 33.65,51.44 J10.2 35.94,54.61 36.07,54.48 U203.6
-DTR
  Top 0.305: J10.3 32.38,51.44 31.24,50.29 31.24,39.88 32.38,38.73 J9.3 33.65,33.02 35.69,33.02 36.83,34.16 36.83,41.27 37.46,41.91 U204.7
-RX  (via drill 0.33)
  Top 0.305: U205.7 39.37,29.97 38.61,30.73 29.84,30.73 27.3,33.27 J9.7 | v27.69,38.86 28.96,40.13 28.96,50.42 J10.7
  Bottom 0.305: J9.7 27.3,38.48 v27.69,38.86
-TX
  Top 0.305: 35.05,52.2 J10.1 | J10.1 34.92,51.69 32.89,49.66 32.89,40.64 34.04,39.5 34.04,38.35 34.92,37.47 J9.1 | U203.7 36.07,53.21 J10.1
_IO24
  Top 0.203: J6.2 102.8,3.1 103.46,3.77 Q121.B Q121.E 103.46,7.07 Q122.3(D)
_IO25
  Top 0.203: J6.4 95.8,3.72 95.89,3.81 95.89,4.47 Q131.E Q131.B 95.93,7.07 Q132.3(D)
_IO26
  Top 0.203: J5.2 83.58,2.54 Q125.B Q125.E 85.3,6.56 Q126.3(D)
_IO27
  Top 0.203: J5.4 75.86,3.11 Q136.E Q136.B 77.13,6.82 Q137.3(D)
ADC0
  Top 0.203: R138.2 101,14.06 99.19,15.88 99.19,17.53 C107.1 98.04,18.03 97.28,18.8 97.28,28.96 96.77,29.46 86.23,29.46 84.45,31.24 84.45,35.2 U5.37
ADC1
  Top 0.203: R144.2 97.54,14.86 97.92,15.24 97.92,16.26 C108.1 96.65,28.7 96.52,28.83 85.98,28.83 83.82,30.99 83.82,34.71 U5.36
ADC2  (via drill 0.33)
  Top 0.203: R141.2 C110.1 82.8,16.13 v82.8,17.27 | U5.35 82.68,34.72 82.68,34.67 82.93,34.42 v82.93,34.29
  Bottom 0.203: v82.93,34.29 83.44,33.78 83.44,17.91 v82.8,17.27
ADC3  (via drill 0.33)
  Top 0.203: U5.34 81.92,34.35 v81.92,33.66
  Top 0.305: R149.2 78.36,14.31 v78.36,14.73 78.49,14.61 C111.1
  Bottom 0.203: v81.92,33.66 82.8,32.77 82.8,18.54 78.99,14.73 v78.36,14.73
ADC4
  Top 0.203: U5.33 77.6,33.84 77.6,31.11 75.95,29.46 74.17,29.46 71.5,26.8 71.5,26.67 70.36,25.53 TP4.TP
ADC5
  Top 0.203: U5.32 76.96,34.34 76.96,31.5 75.56,30.1 73.91,30.1 71.76,27.94 71.5,27.94 70.87,27.3 TP5.TP
ADC6
  Top 0.203: U5.31 76.33,34.83 76.33,31.88 75.18,30.73 73.53,30.73 72.01,29.21 TP6.TP
ADC7
  Top 0.203: U5.30 75.69,35.33 75.69,32.13 74.93,31.37 73.03,31.37 72.77,31.11 TP7.TP
ALT_EN  (via drill 0.33)
  Top 0.203: v47.75,52.2 48.01,52.2 48.39,51.82 53.85,51.82 54.48,51.18 55.24,51.18 55.37,51.05 57.4,51.05 57.91,50.55 59.44,50.55 v59.82,50.93 | v40.39,61.98 38.97,61.98 R14.1 38.02,61.03 Q10.1(G) | J11.4 67.56,38.61 66.8,38.61 65.91,37.72 64.9,37.72 64.01,36.83 63.41,36.83 U206.15 62.39,37.85 61.59,37.85 61.21,37.47 60.71,37.47 60.45,37.72 59.05,37.72 58.42,38.35 v58.42,38.48
  Bottom 0.203: v47.75,52.2 47.37,52.58 47.24,52.58 46.61,53.21 46.61,59.69 45.85,60.45 42.54,60.45 41.27,61.72 40.64,61.72 v40.39,61.98 | v58.42,38.48 58.29,38.61 57.66,38.61 57.4,38.35 54.36,38.35 54.23,38.48 54.23,40.13 54.86,40.77 54.86,42.29 53.97,43.18 53.97,44.45 54.99,45.47 56.13,45.47 56.39,45.72 57.53,45.72 59.44,47.62 59.44,50.55 v59.82,50.93
ALT_I  (via drill 0.33)
  Top 0.203: R4.1 23.03,39.54 v24,40.51 | v16.76,26.92 15.88,26.04 13.84,26.04 v13.72,25.91 | U206.23 60.71,44.1 v60.71,44.7
  Bottom 0.203: v24,40.51 23.11,40.51 21.97,39.37 21.97,33.15 21.21,32.38 18.67,32.38 17.4,31.11 17.4,29.97 16.51,29.08 16.51,27.18 v16.76,26.92 | v13.72,25.91 13.97,25.65 13.97,23.88 25.15,12.7 41.53,12.7 44.07,10.16 48.13,10.16 50.55,12.57 50.55,14.1 51.43,14.99 51.43,17.27 51.82,17.65 53.97,17.65 56.51,20.19 56.9,20.19 57.78,21.08 59.69,21.08 60.2,21.59 65.15,21.59 69.09,25.53 69.09,28.07 69.98,28.96 69.98,30.99 70.99,32 70.99,34.67 70.36,35.31 70.36,37.72 70.99,38.35 70.99,42.93 69.6,44.32 61.09,44.32 v60.71,44.7
ALT_V  (via drill 0.33)
  Top 0.203: 32.77,58.8 C9.1 31.03,57.06 R1.1 | 32.77,58.8 33.57,58.8 R13.2 35.63,57.43 Q11.1(G) | 32.77,58.8 32,59.56 v31.88,59.56 | U206.24 58.93,43.46 58.93,42.8 57.4,41.27 v57.28,41.27
  Bottom 0.203: v31.88,59.56 31.88,58.04 30.86,57.02 25.4,57.02 23.62,55.24 23.62,50.8 20.45,47.62 20.45,43.05 21.34,42.16 21.34,33.4 20.96,33.02 18.41,33.02 16.76,31.37 16.76,30.23 15.88,29.34 15.88,24.77 26.04,14.61 42.29,14.61 44.83,12.06 47.37,12.06 48.64,13.34 48.64,14.99 49.53,15.88 49.53,18.16 51.05,19.68 53.34,19.68 55.63,21.97 56.39,21.97 57.02,22.61 58.93,22.61 59.56,23.24 64.14,23.24 67.44,26.54 67.44,28.96 68.33,29.84 68.33,31.11 67.18,32.26 67.18,33.78 66.17,34.8 66.17,35.56 66.67,36.07 66.67,36.83 65.79,37.72 62.36,37.72 61.85,38.23 61.85,38.73 61.34,39.24 60.83,39.24 59.56,40.51 58.17,40.51 57.4,41.27 v57.28,41.27
AREF
  Top 0.203: U5.29 74.55,35.32 C15.1
CS0_22MA
  Top 0.203: Q123.C J6.1
CS0_EN
  Top 0.203: R146.2 100.44,23.35 101.6,24.51 101.6,29.08 100.84,29.84 99.44,29.84 98.55,30.73 98.55,32.38 98.3,32.64 96.27,32.64 96.14,32.51 95.12,32.51 94.87,32.26 88.39,32.26 87.25,33.4 87.25,35.8 U5.40
CS1_22MA
  Top 0.203: J6.5 92.3,3.95 Q133.C
CS1_EN  (via drill 0.33)
  Top 0.203: U5.13 77.3,49.15 77.3,49.61 77.85,50.16 v78.99,50.16 | R147.2 90.66,21.34 v92.96,21.34
  Bottom 0.203: v92.96,21.34 92.96,26.04 92.46,26.54 92.46,27.3 92.71,27.56 92.71,33.02 90.17,35.56 90.17,37.72 87.63,40.26 85.85,40.26 81.79,44.32 81.03,44.32 79.12,46.23 79.12,47.12 79.25,47.24 79.25,49.91 v78.99,50.16
CS2_22MA
  Top 0.203: J5.1 86.36,2.58 Q127.C
CS2_EN  (via drill 0.33)
  Top 0.203: U5.43 86.95,39.5 88.01,39.5 88.65,38.86 88.65,34.8 89.03,34.42 v89.03,33.15 | R151.2 85.51,19.68 v86.74,19.68
  Bottom 0.203: v89.03,33.15 88.77,32.89 88.14,32.89 87.38,32.13 87.38,27.94 87.63,27.69 87.63,20.57 v86.74,19.68
CS3_22MA
  Top 0.203: J5.5 72.36,2.93 Q138.C
CS3_EN  (via drill 0.33)
  Top 0.203: U5.26 75.46,39.62 76.45,39.62 76.84,40.01 77.72,40.01 v78.23,39.5 | v68.2,13.21 68.62,13.21 R152.2
  Bottom 0.203: v78.23,39.5 78.49,39.24 78.49,38.35 76.71,36.58 76.71,25.78 76.07,25.15 76.07,24.38 76.58,23.88 76.84,23.88 77.22,23.5 77.22,20.45 76.07,19.3 76.07,18.54 70.48,12.95 68.45,12.95 v68.2,13.21
CS4_22MA
  Top 0.203: Q145.C 50.04,3.78 J4.6
CS4_EN  (via drill 0.33)
  Top 0.203: U5.41 87.88,36.3 87.88,34.04 v88.14,33.78 | R157.2 87.08,26.2 v86.74,26.54
  Bottom 0.203: v88.14,33.78 86.74,32.38 v86.74,26.54
CS_DIVERSION  (via drill 0.33)
  Top 0.203: v74.17,24.38 74.17,23.75 73.15,22.73 55.24,22.73 54.74,23.24 54.74,23.37 52.96,25.15 51.31,25.15 51.05,25.4 49.53,25.4 49.4,25.55 49.29,25.65 Q118.3(D) | U5.25 75.22,40.51 v76.07,40.51
  Bottom 0.203: v76.07,40.51 76.45,40.51 77.34,39.62 77.34,38.1 76.2,36.96 76.2,29.59 74.93,28.32 74.93,27.81 74.42,27.3 74.42,26.04 74.55,25.91 74.55,24.77 v74.17,24.38
CS_DIVERSION_22MA
  Top 0.203: Q116.C 43.1,2.58 J3.1
CS_FAST  (via drill 0.33)
  Top 0.203: U5.21 74.34,43.05 75.18,43.05 75.44,43.31 75.69,43.31 76.07,42.93 76.2,42.93 77.09,42.04 v77.22,42.04 | R137.1 38.9,13.93 39.75,13.08 42.54,13.08 43.43,13.97 44.96,13.97 45.85,14.86 46.86,14.86 47.62,15.62 48.26,15.62 49.4,16.76 56.01,16.76 56.51,16.26 57.78,16.26 v58.04,16.51
  Bottom 0.203: v58.04,16.51 57.78,16.26 57.78,14.99 58.67,14.1 58.67,11.94 59.05,11.56 63.88,11.56 65.15,12.83 67.31,12.83 67.82,12.32 70.74,12.32 76.58,18.16 76.58,19.05 77.72,20.19 77.72,35.94 79.63,37.85 79.63,40.39 78.87,41.15 77.98,41.15 77.47,41.66 77.47,41.78 v77.22,42.04
CS_FAST_22MA
  Top 0.203: Q119.C 40.74,3.73 J3.2
CS_ICP1  (via drill 0.33)
  Top 0.203: U5.14 78.36,46.95 78.36,46.86 78.61,46.61 78.61,42.16 v78.36,42.04 | v56.9,17.14 56.64,17.4 49.15,17.4 48.01,16.26 47.37,16.26 46.61,15.49 45.59,15.49 44.7,14.61 43.18,14.61 42.29,13.72 40.13,13.72 38.73,15.11 37.46,15.11 36.7,14.35 36.7,12.7 36.07,12.06 34.33,12.06 R103.1
  Bottom 0.203: v78.36,42.04 78.74,42.04 80.14,40.64 80.14,37.59 78.23,35.69 78.23,19.94 77.09,18.8 77.09,17.78 70.99,11.68 67.69,11.68 67.06,12.32 65.53,12.32 64.14,10.92 58.8,10.92 58.04,11.68 58.04,13.84 57.15,14.73 57.15,16.89 v56.9,17.14
CS_ICP1_17MA
  Top 0.203: Q101.C 30.86,4.06 30.48,3.68 J2.1
CS_ICP3  (via drill 0.33)
  Top 0.203: U5.24 74.98,41.4 v75.44,41.4 | v75.31,21.21 75.31,21.59 76.07,22.35 76.07,22.86 76.45,23.24 80.14,23.24 80.39,22.99 83.57,22.99 84.07,22.48 88.01,22.48 89.41,23.88 93.73,23.88 v93.98,23.62 | Q105.3(D) 92.58,38.23 v93.73,37.08
  Bottom 0.203: v75.44,41.4 75.44,41.15 75.06,40.77 75.06,40.13 75.56,39.62 76.45,39.62 76.71,39.37 76.71,38.35 75.69,37.34 75.69,29.84 74.42,28.57 74.42,28.07 73.91,27.56 73.91,25.4 73.28,24.77 73.28,23.88 73.79,23.37 74.42,23.37 75.31,22.48 v75.31,21.21 | v93.98,23.62 94.23,23.88 94.23,27.3 93.98,27.56 93.98,36.83 v93.73,37.08
CS_ICP3_17MA
  Top 0.203: Q103.C 23.24,3.68 23.5,3.43 23.5,2.56 J2.3
CS_ICP4  (via drill 0.33)
  Top 0.203: R113.1 20.96,14.99 21.84,15.88 22.73,15.88 23.37,16.51 24.89,16.51 25.91,15.49 35.18,15.49 36.7,17.02 39.5,17.02 40.89,15.62 41.53,15.62 42.42,16.51 43.94,16.51 44.83,17.4 45.72,17.4 46.99,18.67 58.04,18.67 59.18,17.53 61.72,17.53 62.36,18.16 66.29,18.16 66.93,18.8 71.25,18.8 71.63,19.18 v72.14,19.18 | U5.23 72.39,39.95 72.39,39.24 73.41,38.23 v73.41,37.85
  Bottom 0.203: v72.14,19.18 72.64,19.18 72.9,19.43 72.9,22.48 72.26,23.11 72.26,25.27 72.9,25.91 72.9,28.07 73.41,28.57 73.41,29.08 74.68,30.35 74.68,37.47 74.3,37.85 v73.41,37.85
CS_ICP4_17MA
  Top 0.203: Q107.C 15.55,3.47 J2.5
DTR_!RE  (via drill 0.33)
  Top 0.203: U206.10 59.02,35.56 v58.93,35.56 | R221.2 46.48,41.02 v46.23,41.27 45.59,41.91 U204.2
  Bottom 0.203: v58.93,35.56 60.71,35.56 62.36,33.91 62.36,33.66 63.63,32.38 63.63,30.86 64.26,30.23 64.26,27.94 63.25,26.92 58.67,26.92 58.17,27.43 56.77,27.43 54.86,25.53 53.09,25.53 48.01,30.61 45.47,30.61 44.83,31.24 44.83,39.62 46.23,41.02 v46.23,41.27
DTR_DE  (via drill 0.33)
  Top 0.203: U206.11 59.82,35.9 v59.82,36.45 | v43.56,42.55 46.23,42.55 46.86,41.91 47.88,41.91 49.28,43.31 R225.2
  Bottom 0.203: v59.82,36.45 59.94,36.32 60.96,36.32 61.85,35.43 63.12,35.43 63.63,34.92 63.63,33.91 64.64,32.89 64.64,31.5 65.53,30.61 65.53,27.69 63.63,25.78 58.42,25.78 57.78,25.15 56.77,25.15 55.63,24 53.09,24 52.07,22.99 52.07,21.97 51.56,21.46 50.8,21.46 50.29,21.97 50.29,22.86 51.43,24 51.43,25.4 47.5,29.34 44.96,29.34 43.56,30.73 v43.56,42.55
DTR_RXD  (via drill 0.33)
  Top 0.203: U206.30 54.1,41.61 54.1,42.29 53.21,43.18 52.2,43.18 50.16,45.21 48.77,45.21 v48.51,45.47 | R226.2 48.64,39.12 v49.02,39.5
  Bottom 0.203: v48.51,45.47 49.15,44.83 49.15,39.62 v49.02,39.5
DTR_TXD
  Top 0.203: U206.31 53.47,41.11 53.47,42.04 52.96,42.55 51.94,42.55 49.91,44.58 46.86,44.58 46.74,44.45 U204.4 44.96,45.89 R224.2
ESD_NODE0
  Top 0.203: Q131.C 98.81,5.46 C109.1 | Q121.C 100.71,5.33 C109.1 | C109.1 99.7,8.17 R148.2
ESD_NODE1
  Top 0.203: Q136.C 80.39,5.33 C112.1 | C112.1 R153.2 | Q125.C 82.3,5.21 C112.1
ESD_NODE2  (via drill 0.33)
  Top 0.305: R163.2 68.83,6.73 v69.85,5.71 69.09,4.95 C113.1 | Q141.C Q142.C 56.3,5.29 v57.15,4.45 | Q150.C 63.25,5.33 | 63.25,5.33 Q151.C | v63.25,4.45 63.25,5.33
  Bottom 0.305: v69.85,5.71 69.6,5.46 64.26,5.46 v63.25,4.45 v57.15,4.45
HOST_!CTS  (via drill 0.33)
  Top 0.203: v51.56,56.64 52.07,56.13 U202.11 | v50.8,47.5 51.05,47.75 52.36,47.75 R210.1 54.05,46.3 v55.12,47.37 | v52.7,41.66 52.7,40.74 U206.32
  Bottom 0.203: v50.8,47.5 50.67,47.5 50.29,47.88 50.29,51.82 51.05,52.58 51.05,56.13 v51.56,56.64 | v55.12,47.37 54.61,47.37 52.45,45.21 52.45,41.91 v52.7,41.66
HOST_!RTS  (via drill 0.33)
  Top 0.203: U201.8 65.88,54.61 v65.02,54.61 | R204.1 68.83,45.97 69.85,46.99 69.85,48.77 v69.98,48.9 | U206.1 53,37.93 v52.58,38.35
  Bottom 0.203: v69.98,48.9 69.09,48.9 68.71,48.51 67.44,48.51 66.04,49.91 66.04,50.04 | 66.04,50.04 66.04,54.23 65.66,54.61 v65.02,54.61 | v52.58,38.35 53.21,38.99 53.21,40.77 53.59,41.15 53.59,41.91 52.96,42.55 52.96,44.96 54.48,46.48 55.63,46.48 55.88,46.74 56.9,46.74 58.17,48.01 58.17,49.4 57.91,49.66 57.91,51.56 58.42,52.07 60.2,52.07 60.96,51.31 60.96,50.55 61.47,50.04 66.04,50.04
HOST_RX  (via drill 0.33)
  Top 0.203: U201.3 71.12,59.05 70.48,58.42 v69.22,58.42 | v66.93,51.31 66.8,51.18 63.37,51.18 63.12,50.93 60.96,50.93 59.94,49.91 57.66,49.91 57.02,50.55 54.1,50.55 53.72,50.16 52.96,50.16 52.45,50.67 49.66,50.67 49.15,50.16 46.86,50.16 46.23,50.8 R206.1 45.72,50.8 44.45,52.07 43.43,52.07 43.31,51.94 U203.1
  Bottom 0.203: 69.22,58.17 v69.22,58.42 69.22,58.04 67.18,56.01 67.18,51.56 v66.93,51.31
HOST_TX  (via drill 0.33)
  Top 0.203: U201.6 v67.31,58.17 | R205.1 64.73,56.52 v65.02,56.52 | v53.34,51.05 53.09,51.31 49.15,51.31 v48.77,51.05 | R234.1 47.62,33.15 v47.5,33.02 46.48,33.02 45.97,32.51 U205.4
  Bottom 0.203: v67.31,58.17 67.31,57.91 65.91,56.52 v65.02,56.52 61.09,56.52 60.32,57.28 58.04,57.28 55.37,54.61 54.36,54.61 53.59,53.85 53.59,51.31 v53.34,51.05 | v48.77,51.05 49.02,50.8 49.02,47.24 47.62,45.85 47.62,45.09 48.01,44.7 48.01,42.67 48.39,42.29 48.39,40.39 47.5,39.5 v47.5,33.02
ICP1  (via drill 0.33)
  Top 0.203: U5.15 77.72,46.46 77.72,46.35 78.11,45.97 78.11,44.2 77.47,43.56 77.47,43.43 v77.22,43.18 | v76.96,24.77 75.06,24.77 74.55,25.27 73.79,25.27 71.88,23.37 55.63,23.37 53.21,25.78 51.43,25.78 50.63,26.58 R121.2 49.44,27.43 47.24,27.43 v46.99,27.18 | v47.62,17.14 47.24,17.14 46.23,16.13 45.34,16.13 44.45,15.24 42.93,15.24 42.04,14.35 40.39,14.35 38.99,15.75 37.21,15.75 35.69,14.22 28.79,14.22 28.03,13.46 R122.2
  Bottom 0.203: v76.96,24.77 77.22,25.02 77.22,36.2 79.12,38.1 79.12,40.13 78.61,40.64 77.34,40.64 76.33,41.66 76.33,42.42 76.71,42.8 76.84,42.8 v77.22,43.18 | v47.62,17.14 46.99,17.78 46.99,22.35 48.01,23.37 48.01,24.26 46.99,25.27 v46.99,27.18
ICP1__
  Top 0.203: R120.2 28.19,9.76 Q111.B
ICP3/MOSI  (via drill 0.33)
  Top 0.203: J12.4 92.58,46.1 92.46,45.97 91.95,45.97 91.31,45.34 91.31,44.07 90.55,43.31 87.06,43.31 U5.1 86.94,42.98 v87.5,42.42 | v99.95,53.85 99.95,56.55 R219.1 | v95.12,26.54 95.12,25.91 93.73,24.51 89.15,24.51 87.76,23.11 84.33,23.11 83.31,24.13 R110.1
  Bottom 0.203: J12.4 93.85,48.39 93.85,49.78 95.63,51.56 97.66,51.56 v99.95,53.85 | v87.5,42.42 87.76,42.16 88.27,42.16 91.95,38.48 93.73,38.48 94.62,37.59 94.62,27.81 94.87,27.56 94.87,26.8 v95.12,26.54
ICP3__  (via drill 0.33)
  Top 0.203: R124.2 20.57,11.3 20.32,11.56 20.32,13.34 v20.45,13.46 | 17.64,22.35 Q113.B 16.7,22.29 16,21.59 16,19.68 16.89,18.8 v16.89,18.41
  Bottom 0.203: v20.45,13.46 20.45,14.99 19.68,15.75 18.16,15.75 16.89,17.02 v16.89,18.41
ICP3_ONESHOT
  Top 0.203: R107.2 30.48,28.45 31.62,27.3 31.62,24.51 32.13,24 U101.3 33.27,24 34.71,22.57 R134.1 36.61,22.57 36.92,22.26 R109.1
ICP3_TIMING_RAMP
  Top 0.203: R107.1 28.11,26.89 29.21,25.78 29.21,24.64 28.57,24 U101.6 25.53,24 24.26,25.27 23.11,25.27 22.73,25.65 22.73,26.04 21.88,26.89 R108.1 21.46,28.57 21.21,28.83 21.12,29.21 C101.1
ICP4  (via drill 0.33)
  Top 0.203: v73.91,22.35 73.66,22.1 54.74,22.1 54.23,22.61 54.23,22.99 52.7,24.51 51.05,24.51 50.8,24.77 48.64,24.77 48.57,24.7 Q118.1(G) 46.17,24.7 45.72,24.26 45.72,23.62 44.96,22.86 44.2,22.86 42.04,20.7 39.12,20.7 38.61,20.19 37.21,20.19 36.45,19.43 33.53,19.43 32.38,18.29 26.29,18.29 24.77,19.81 22.86,19.81 22.23,19.18 20.32,19.18 18.67,20.83 18.67,22.23 | R118.2 16.8,23.2 16.89,23.24 18.41,23.24 18.67,22.99 18.67,22.23 | R117.2 22.31,23.58 22.23,23.5 20.83,23.5 20.07,22.73 20.07,22.35 19.94,22.23 18.67,22.23 | U5.22 73.08,42.98 v72.52,42.42
  Bottom 0.203: v72.52,42.42 73.28,42.42 74.55,41.15 74.55,39.88 75.44,38.99 75.44,37.97 75.18,37.72 75.18,30.1 73.91,28.83 73.91,28.32 73.41,27.81 73.41,25.65 72.77,25.02 72.77,23.5 v73.91,22.35
ICP4__
  Top 0.203: R128.2 11.68,8.53 Q115.B
ICP4_ONESHOT
  Top 0.203: R115.1 12.79,13.37 11.56,14.61 11.56,14.99 11.43,15.11 U102.3 9.65,15.11 9.14,15.62 9.14,17.11 R114.2
ICP4_TIMING_RAMP
  Top 0.203: R114.1 4.53,18.16 C104.1 4.28,16.81 R116.1 3.01,15.11 U102.6
LS_ICP1
  Top 0.203: J2.2 26.98,4.05 R119.2 27.18,4.74 R120.1
LS_ICP3
  Top 0.203: J2.4 19.98,3.64 R123.2 20.92,5.5 20.57,5.84 R124.1
LS_ICP4
  Top 0.203: J2.6 12.32,3.2 12.32,3.56 11.68,4.19 R128.1 10.75,5.17 R127.2
MGR_!RESET  (via drill 0.33)
  Top 0.203: R228.1 67.75,34.19 D201.A | D201.A 65.41,34.31 J11.5 | U206.29 56.46,40.39 57.02,40.39 v57.28,40.13 | v64.39,34.42 64.52,34.29 65.68,34.29 D201.A
  Bottom 0.203: v57.28,40.13 57.4,40.01 59.18,40.01 60.07,39.12 60.07,37.97 60.32,37.72 60.45,37.72 62.1,36.07 63.25,36.07 64.14,35.18 64.14,34.67 v64.39,34.42
MGR_!SS!  (via drill 0.33)
  Top 0.203: 44.83,53.59 v44.58,53.59 45.12,54.14 R240.1 | U206.14 62.87,36.24 v62.87,34.54
  Bottom 0.203: v62.87,34.54 63.12,34.29 63.12,33.66 64.14,32.64 64.14,31.24 64.9,30.48 64.9,27.81 63.5,26.42 58.29,26.42 57.78,26.92 57.02,26.92 55.12,25.02 52.83,25.02 47.88,29.97 45.21,29.97 44.2,30.99 44.2,40.01 45.34,41.15 45.34,41.66 45.97,42.29 45.97,43.81 44.83,44.96 44.83,53.34 v44.58,53.59
MGR_AREF
  Top 0.305: U206.20 62.61,42.61 62.61,43.56 62.74,43.69 C208.1
MGR_MISO
  Top 0.203: U206.16 63.88,38.38 63.88,39.37 65.41,40.89 J11.1
MGR_SCK  (via drill 0.33)
  Top 0.203: D202.K 11.05,25.4 11.43,25.02 14.1,25.02 14.22,25.15 17.53,25.15 v17.65,25.27 | v43.18,19.43 43.56,19.81 44.2,19.81 45.59,21.21 46.48,21.21 48.51,23.24 52.32,23.24 52.96,22.61 v52.96,21.72 | v60.96,38.35 61.09,38.48 61.87,38.48 U206.17 64.14,40.74 64.14,42.42 64.52,42.8 66.29,42.8 66.67,42.42 66.67,40.51 66.04,39.88 66.04,39.62 J11.3
  Bottom 0.203: v17.65,25.27 19.3,25.27 22.86,21.72 25.4,21.72 27.43,19.68 31.88,19.68 32.89,20.7 43.05,20.7 43.43,20.32 43.43,19.56 v43.18,19.43 | v52.96,21.72 52.83,21.84 52.83,22.86 53.47,23.5 55.88,23.5 57.02,24.64 58.04,24.64 58.67,25.27 63.88,25.27 66.04,27.43 66.04,30.99 65.28,31.75 65.28,34.8 63.37,36.7 62.36,36.7 60.96,38.1 v60.96,38.35
MISO  (via drill 0.33)
  Top 0.203: U5.2 87.08,44.45 88.39,44.45 88.77,44.83 88.77,45.09 89.54,45.85 90.55,45.85 91.31,46.61 91.31,47.62 90.04,48.9 J12.1 | v98.04,54.48 98.04,55.12 98.68,55.75 98.68,57.02 97.66,58.04 97.66,62.61 96.52,63.75 91.82,63.75 91.06,62.99 80.9,62.99 80.52,62.61 78.23,62.61 77.98,62.87 72.01,62.87 71.5,62.36 70.74,62.36 70.23,62.87 69.22,62.87 68.83,62.48 66.29,62.48 65.15,63.63 v65.15,63.88 | v59.69,63.37 59.31,63.37 58.42,62.48 57.66,62.48 57.02,63.12 53.47,63.12 52.96,62.61 52.96,61.72 53.34,61.34 U202.3
  Bottom 0.203: J12.1 90.04,49.78 91.82,51.56 93.85,51.56 95.12,52.83 96.9,52.83 98.04,53.98 v98.04,54.48 | v65.15,63.88 65.15,61.59 64.77,61.21 64.14,61.21 62.99,60.07 60.58,60.07 59.44,61.21 59.44,63.12 v59.69,63.37
N$1
  Top 0.203: Q128.B 87.31,11.28 R143.1
  Top 0.61: Q128.B Q127.E
N$2
  Top 0.203: Q8.1(G) 35.84,64.96 R11.2 35.94,65.11 R12.1
N$3
  Top 0.203: Q110.B 34.99,8.61 R103.2
N$4
  Top 0.203: R12.2 40.26,67.06 41.45,65.87 Q9.3(D)
N$5
  Top 0.203: Q5.B 10.35,61.11 R16.2
  Top 0.61: Q7.C 11.3,58.17 10.5,58.97 Q5.B
N$6  (via drill 0.33)
  Top 0.203: 9.8,53.15 Q6.C 12.49,52.2 R5.2 | Q4.1(G) 10.46,66.34 9.27,65.15 9.27,64.26 v9.14,64.14 | Q6.B 9.8,53.15 | 9.8,53.15 9.8,55.78 v9.91,55.88 10.35,56.33 Q7.E
  Bottom 0.203: v9.91,55.88 11.3,57.4 11.3,61.09 9.65,62.74 9.65,63.63 v9.14,64.14
N$7  (via drill 0.33)
  Top 0.203: Q5.C 11.3,61.85 12.19,62.74 12.19,63.5 v12.32,63.63
  Bottom 0.203: D2.A 13.21,68.07 13.21,64.52 v12.32,63.63
N$8
  Top 0.203: U2.1 18.15,44.61 C5.1 19.51,45.12 R9.2
N$9
  Top 0.203: Q128.C 88.27,12.23 R142.2
  Top 0.61: Q128.C 88.27,7.64 Q127.B
N$10
  Top 0.203: Q7.B 12.25,55.18 12.57,54.86 R5.1
  Top 0.61: Q5.E Q7.B
N$11
  Top 0.203: Q104.B 22.29,10.6 21.63,11.26 R104.1
  Top 0.61: Q104.B Q103.E
N$12
  Top 0.203: Q139.B 72.96,11.41 R150.1
  Top 0.61: Q139.B Q138.E
N$13
  Top 0.203: Q132.2(S) 95.82,10.39 R144.1
N$14
  Top 0.203: Q122.2(S) 101.79,11.4 R138.1
N$15
  Top 0.203: R160.2 71.92,4.74 72.77,5.59 73.76,5.59 Q138.B
  Top 0.61: Q139.C 73.91,7.64 Q138.B
N$16
  Top 0.203: Q103.B 25.02,7.52 25.02,8.76 25.27,9.02 25.27,9.91 24.89,10.29 24.89,11.68 24.77,11.81 24.77,13.93 R105.2
  Top 0.61: Q104.C 23.24,7.64 Q103.B
N$18
  Top 0.203: R129.2 7.71,7.83 9.27,9.4 9.31,9.4 Q115.C 12.32,9.53 12.57,9.78 12.57,11.68 11.68,12.57 11.68,12.83 11.3,13.21 11.3,13.72 11.18,13.84 U102.2
N$19
  Top 0.203: R159.1 93.98,17.7 Q148.C
N$20
  Top 0.203: Q124.B 105.35,9.97 104.65,10.67 R140.1
  Top 0.61: Q123.E Q124.B
N$21
  Top 0.203: R139.1 106.68,15.71 Q135.C
N$22
  Top 0.203: R106.2 88.43,27.43 84.45,27.43 83.44,28.45 83.44,29.21 82.13,30.52 Q112.B
N$23
  Top 0.203: Q124.C 106.3,11.18 106.68,11.56 R139.2
  Top 0.61: Q124.C 106.3,7.64 Q123.B
N$24
  Top 0.203: Q108.B 13.78,11.28 R111.1
  Top 0.61: Q108.B Q107.E
N$25
  Top 0.203: Q107.B 16.55,5.67 R112.2
  Top 0.61: Q108.C 14.73,6.62 Q107.B
N$27
  Top 0.203: R115.2 13.7,15.33 Q109.B
N$28
  Top 0.203: R145.1 91.89,12.17 Q134.B
  Top 0.61: Q134.B Q133.E
N$29
  Top 0.203: Q134.C 92.84,10.79 93.98,11.94 R159.2
  Top 0.61: Q134.C 92.84,7.64 Q133.B
N$30
  Top 0.203: Q114.B 19.11,13.95 R113.2
N$31  (via drill 0.33)
  Top 0.203: v28.57,61.21 Q1.SINK | R1.2 30.35,60.71 30.73,61.09 v30.73,62.48
  Top 1.778: J8.3 24.89,68.59 Q1.SINK
  Bottom 0.203: v30.73,62.48 30.35,62.87 29.72,62.87 28.57,61.72 v28.57,61.21
N$32
  Top 0.203: R2.2 18.12,53.23 Q2.E 18.09,55.18 18.92,56.01 19.56,56.01 19.68,56.13 | U1.4 21.05,52.99 20.57,53.47 R3.1
  Top 1.422: R3.1 20.57,55.25 20.07,55.75
  Top 1.778: 20.07,55.75 19.68,56.13 19.68,57.98 Q3.3
N$33  (via drill 0.33)
  Top 0.203: v30.99,63.63 31.71,63.63 R15.2 | R2.1 16.17,53.23 Q2.B 16.2,53.28 17.14,54.23 Q2.C 17.14,55.88 v17.78,56.52 | Q1.1 22.69,58 v24.38,59.69 | Q3.1 15.1,58.02 v16.76,59.69
  Bottom 0.203: v17.78,56.52 17.78,59.69 | 17.78,59.69 v16.76,59.69 | 17.78,59.69 v24.38,59.69 25.65,59.69 29.46,63.5 30.86,63.5 v30.99,63.63
N$34
  Top 0.203: R15.1 32.42,61 33.4,61.98 Q10.3(D)
N$35
  Top 0.203: C17.2 98.42,38.73 J14.6
N$36
  Top 0.203: Q148.B 91.7,19.66 R147.1
N$37
  Top 0.203: Q135.B 102.59,16.95 R146.1
N$38
  Top 0.203: R160.1 71.12,8.26 70.48,8.89 Q149.C
N$39
  Top 0.203: R102.1 34.5,5.42 Q110.C
N$40  (via drill 0.33)
  Top 0.203: R105.1 23.66,15.88 24.64,15.88 25.65,14.86 35.43,14.86 36.96,16.38 39.24,16.38 40.64,14.99 41.78,14.99 42.67,15.88 44.2,15.88 45.08,16.76 45.97,16.76 47.24,18.03 57.78,18.03 58.93,16.89 61.98,16.89 62.61,17.53 66.55,17.53 67.18,18.16 71.5,18.16 71.63,18.29 73.28,18.29 v73.53,18.54 | v75.82,27.94 77.98,27.94 78.61,28.57 79.88,28.57 80.52,27.94 82.3,27.94 82.55,28.19 82.55,29.34 81.92,29.97 81.28,29.97 81.03,30.23 81.03,30.52 Q112.C
  Bottom 0.203: v73.53,18.54 74.8,19.81 75.06,19.81 76.2,20.95 76.2,22.73 75.06,23.88 75.06,26.16 74.93,26.29 74.93,27.05 v75.82,27.94
N$41
  Top 0.203: R112.1 17.65,10.08 Q114.C
N$42  (via drill 0.33)
  Top 0.203: v93.34,26.92 91.15,26.92 R106.1 | Q105.2(S) 92.39,37.28 v92.58,37.08
  Bottom 0.203: v93.34,26.92 93.34,35.69 92.58,36.45 v92.58,37.08
N$43
  Top 0.203: U101.2 33.4,22.73 34.29,21.84 34.29,21.08 32.13,18.92 26.54,18.92 25.02,20.45 22.48,20.45 22.39,20.36 R125.2 20.49,21.34 Q113.C
N$44
  Top 0.203: Q109.C 15.62,19.18 14.73,20.07 R118.1
N$45
  Top 0.203: Q117.B 44.9,10.39 R131.1
  Top 0.61: Q117.B Q116.E
N$46
  Top 0.203: R116.2 3.47,13.37 3.94,13.84 U102.7
N$47
  Top 0.203: U102.4 10.41,17.65 C106.1 10.16,17.78 9.4,18.54 9.4,18.92 8.51,19.81 7.49,19.81 7.2,20.11 R130.1
N$48
  Top 0.203: Q106.B 39.18,24.57 38.82,24.22 R109.2
N$49
  Top 0.203: R108.2 22.19,24.93 22.48,24.64 24,24.64 24.51,24.13 24.51,23.11 24.89,22.73 U101.7
N$50  (via drill 0.33)
  Top 0.203: R110.2 80.01,24.38 79.5,23.88 76.2,23.88 75.44,23.11 75.44,22.61 74.3,21.46 54.48,21.46 53.59,22.35 53.59,22.86 52.58,23.88 v47.12,23.88 | v42.8,24.77 42.8,24.38 42.04,23.62 Q106.C
  Bottom 0.203: v47.12,23.88 46.23,24.77 v42.8,24.77
N$51
  Top 0.203: U101.4 32.89,25.65 32.13,26.42 32.13,27.69 31.24,28.57 31.24,29.08 30.48,29.84 29.72,29.84 24.47,35.09 R126.1 24.47,36.11 24.26,36.32 C103.1
N$52
  Top 0.203: Q116.B 45.7,3.68 44.45,3.68 43.69,4.45 43.69,12.41 R132.2
  Top 0.61: Q117.C 45.85,5.73 Q116.B
N$53
  Top 0.203: R133.2 44.11,23.66 42.1,21.65 Q129.B 39.18,21.65 38.35,20.83 36.7,20.83 36.58,20.7 36.07,20.7 R134.2
N$54  (via drill 0.33)
  Top 0.203: R132.1 45.81,13.42 v46.35,13.97 | v46.1,22.1 44.91,22.1 Q129.C
  Bottom 0.203: v46.35,13.97 46.35,21.84 v46.1,22.1
N$55
  Top 0.203: Q118.2(S) 47.81,26.6 47.62,26.42 44.62,26.42 R133.1
N$56
  Top 0.203: Q120.B 40.2,11.66 R135.1
  Top 0.61: Q120.B Q119.E
N$57
  Top 0.203: R136.2 39.54,4.36 40,4.83 41,4.83 Q119.B
  Top 0.61: Q120.C 41.15,6.88 Q119.B
N$58
  Top 0.203: Q130.B 38.41,11.66 R137.2
N$59
  Top 0.203: R136.1 37.72,7.79 Q130.C
N$60
  Top 0.203: R142.1 88.9,15.11 89.92,16.13 89.92,17.48 Q140.C
N$61
  Top 0.203: Q137.2(S) 77.03,10.99 77.47,11.43 R149.1
N$62
  Top 0.203: Q126.2(S) 83.25,11.28 R141.1
N$63
  Top 0.203: Q149.B 71.44,14.07 R152.1
N$64